# Altium schematic sheet CON_USER_BATTER.SchDoc
size 558 x 431 mm
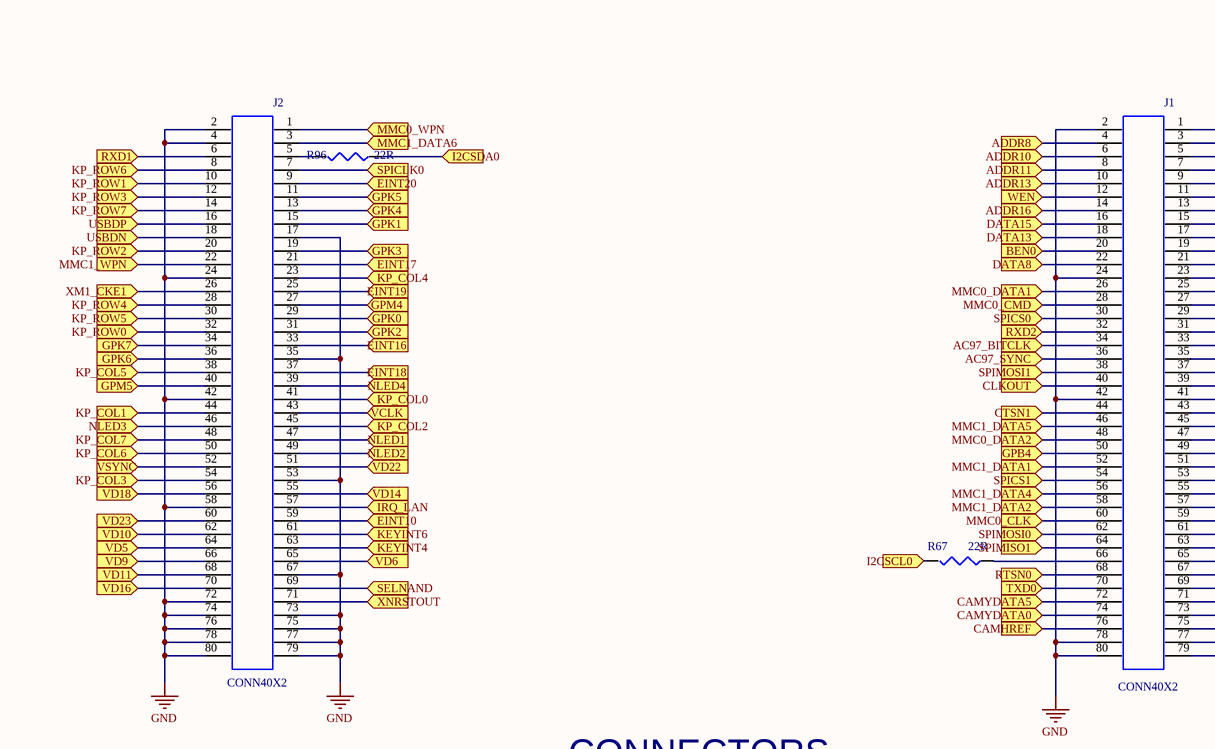
[diagram p0: CON_USER_BATTER.SchDoc, top left]
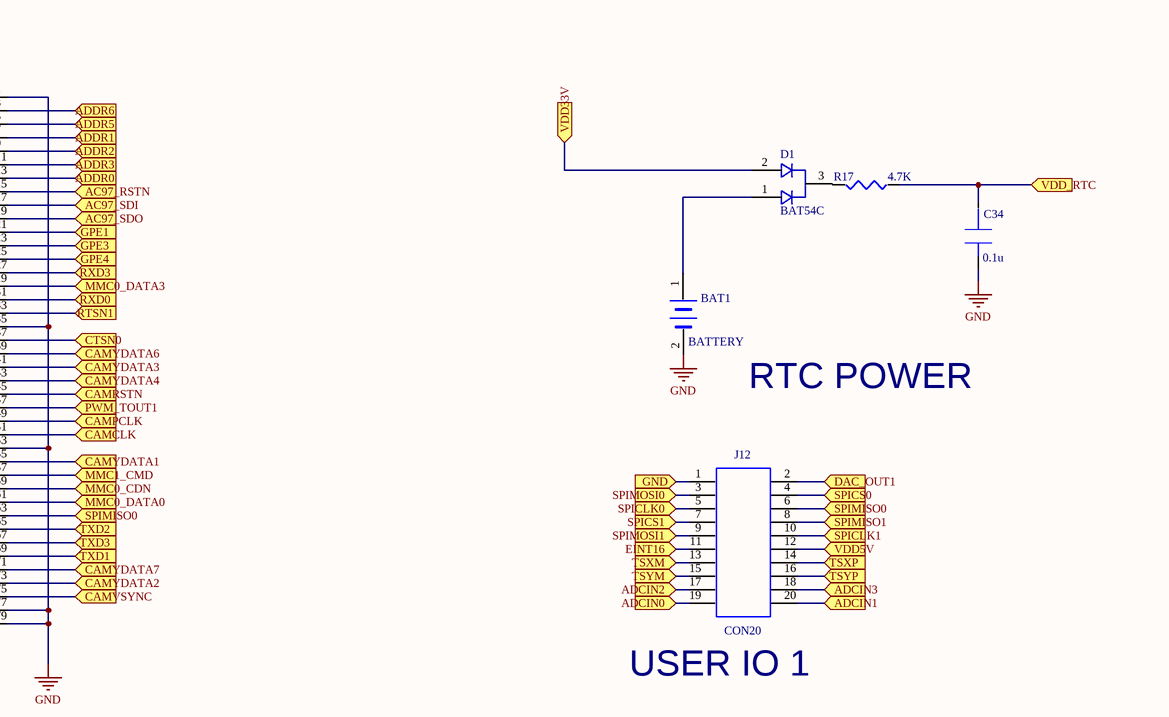
[diagram p1: CON_USER_BATTER.SchDoc, top right]
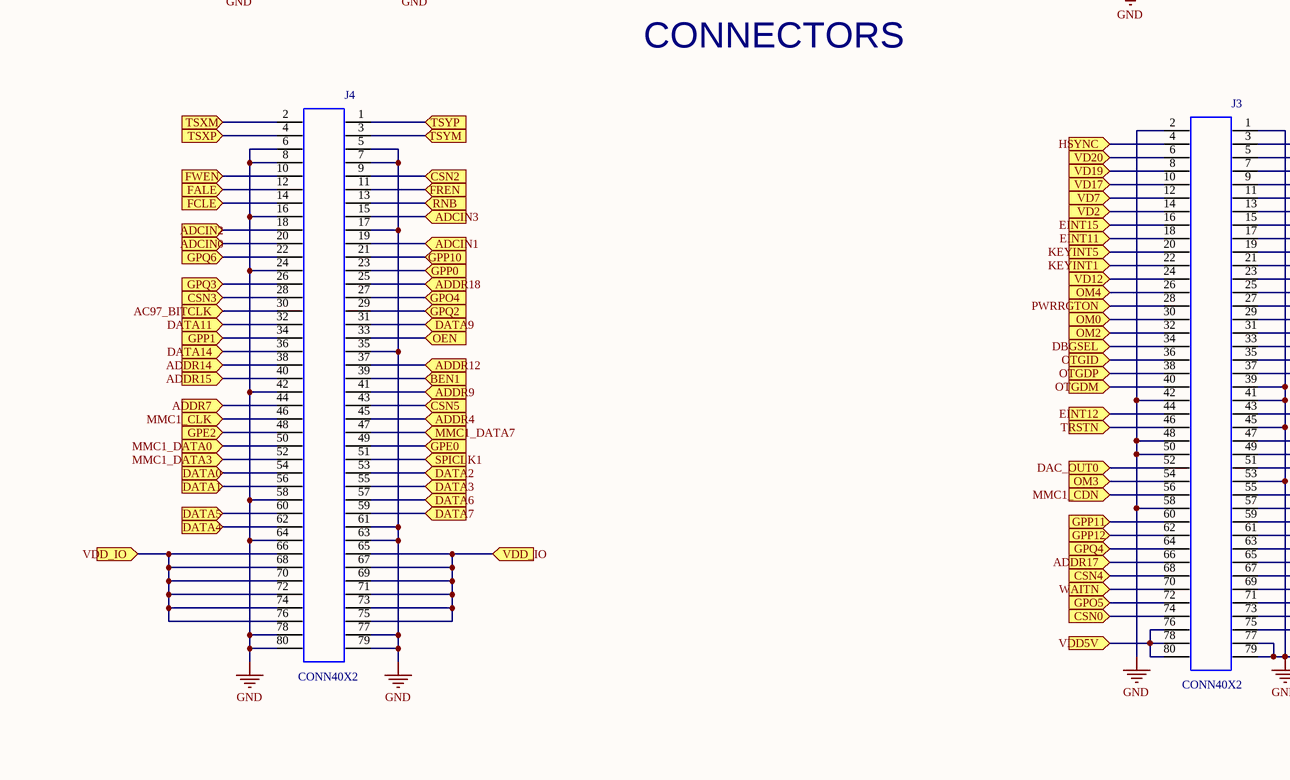
[diagram p2: CON_USER_BATTER.SchDoc, bottom left]
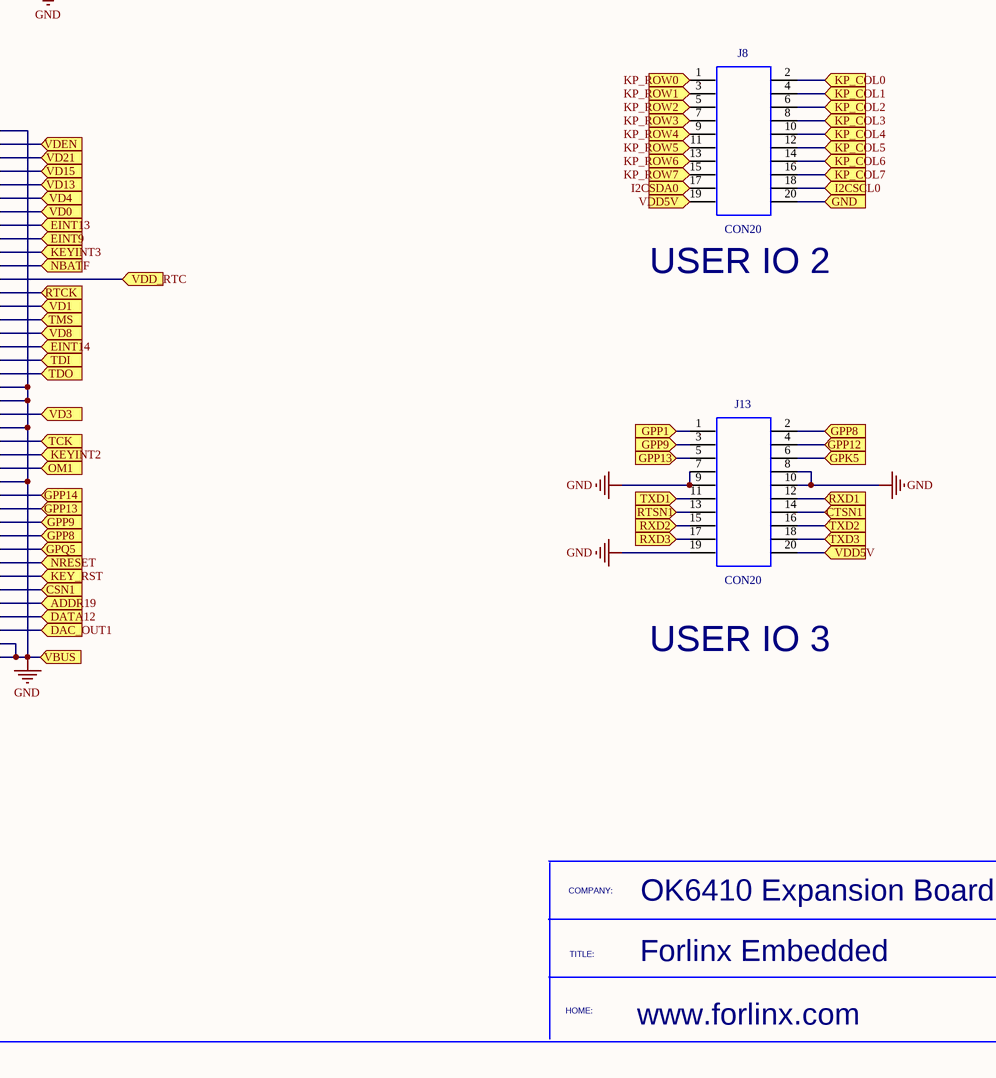
[diagram p3: CON_USER_BATTER.SchDoc, bottom right]

## Parts
BAT1  BATTERY
C34  value 0.1u  (hidden comment: CAP1206)
D1  BAT54C  [SOT23]
J1  CONN40X2
J2  CONN40X2
J3  CONN40X2
J4  CONN40X2
J8  CON20
J12  CON20
J13  CON20
R17  value 4.7K  (hidden comment: RESISTOR_2)
R67  value 22R  (hidden comment: RESISTOR_2)
R96  value 22R  (hidden comment: RESISTOR_2)

## Ports
AC97_BITCLK, AC97_RSTN, AC97_SDI, AC97_SDO, AC97_SYNC, ADCIN0, ADCIN1, ADCIN2, ADCIN3, ADDR0, ADDR1, ADDR2, ADDR3, ADDR4, ADDR5, ADDR6, ADDR7, ADDR8, ADDR9, ADDR10, ADDR11, ADDR12, ADDR13, ADDR14, ADDR15, ADDR16, ADDR17, ADDR18, ADDR19, BEN0, BEN1, CAMCLK, CAMHREF, CAMPCLK, CAMRSTN, CAMVSYNC, CAMYDATA0, CAMYDATA1, CAMYDATA2, CAMYDATA3, CAMYDATA4, CAMYDATA5, CAMYDATA6, CAMYDATA7, CLKOUT, CSN0, CSN1, CSN2, CSN3, CSN4, CSN5, CTSN0, CTSN1, DAC_OUT0, DAC_OUT1, DATA0, DATA1, DATA2, DATA3, DATA4, DATA5, DATA6, DATA7, DATA8, DATA9, DATA11, DATA12, DATA13, DATA14, DATA15, DBGSEL, EINT9, EINT10, EINT11, EINT12, EINT13, EINT14, EINT15, EINT16, EINT17, EINT18, EINT19, EINT20, FALE, FCLE, FREN, FWEN, GND, GPB4, GPE0, GPE1, GPE2, GPE3, GPE4, GPK0, GPK1, GPK2, GPK3, GPK4, GPK5, GPK6, GPK7, GPM4, GPM5, GPO4, GPO5, GPP0, GPP1, GPP8, GPP9, GPP10, GPP11, GPP12, GPP13, GPP14, GPQ2, GPQ3, GPQ4, GPQ5, GPQ6, HSYNC, I2CSCL0, I2CSDA0, IRQ_LAN, KEY_RST, KEYINT1, KEYINT2, KEYINT3, KEYINT4, KEYINT5, KEYINT6, KP_COL0, KP_COL1, KP_COL2, KP_COL3, KP_COL4, KP_COL5, KP_COL6, KP_COL7, KP_ROW0, KP_ROW1, KP_ROW2, KP_ROW3, KP_ROW4, KP_ROW5, KP_ROW6, KP_ROW7, MMC0_CDN, MMC0_CLK, MMC0_CMD, MMC0_DATA0, MMC0_DATA1, MMC0_DATA2, MMC0_DATA3, MMC0_WPN, MMC1_CDN, MMC1_CLK, MMC1_CMD, MMC1_DATA0, MMC1_DATA1, MMC1_DATA2, MMC1_DATA3, MMC1_DATA4, MMC1_DATA5, MMC1_DATA6, MMC1_DATA7, MMC1_WPN, NBATF, NLED1, NLED2, NLED3, NLED4, NRESET, OEN, OM0, OM1, OM2, OM3, OM4, OTGDM, OTGDP, OTGID, PWM_TOUT1, PWRRGTON, RNB, RTCK, RTSN0, RTSN1, RXD0, RXD1, RXD2, RXD3, SELNAND, SPICLK0, SPICLK1, SPICS0, SPICS1, SPIMISO0, SPIMISO1, SPIMOSI0, SPIMOSI1, TCK, TDI, TDO, TMS, TRSTN, TSXM, TSXP, TSYM, TSYP, TXD0, TXD1, TXD2, TXD3, USBDN, USBDP, VBUS, VCLK, VD0, VD1, VD2, VD3, VD4, VD5, VD6, VD7, VD8, VD9, VD10, VD11, VD12, VD13, VD14, VD15, VD16, VD17, VD18, VD19, VD20, VD21, VD22, VD23, VDD5V, VDD33V, VDD_IO, VDD_RTC, VDEN, VSYNC, WAITN, WEN, XM1_CKE1, XNRSTOUT

## Nets
GND: BAT1.2 C34.2 J1.1 J1.2 J1.24 J1.35 J1.42 J1.53 J1.77 J1.78 J1.79 J1.80 J2.2 J2.4 J2.17 J2.24 J2.35 J2.42 J2.53 J2.58 J2.67 J2.72 J2.73 J2.74 J2.75 J2.76 J2.77 J2.78 J2.79 J2.80 J3.1 J3.2 J3.39 J3.41 J3.42 J3.45 J3.48 J3.50 J3.53 J3.58 J3.77 J3.79 J4.5 J4.6 J4.7 J4.8 J4.16 J4.17 J4.24 J4.35 J4.42 J4.58 J4.61 J4.63 J4.64 J4.77 J4.78 J4.79 J4.80 J13.7 J13.8 J13.9 J13.10 J13.19 ; port VBUS
AC97_BITCLK: J1.34 J4.30 ; port AC97_BITCLK
AC97_RSTN: J1.15 ; port AC97_RSTN
AC97_SDI: J1.17 ; port AC97_SDI
AC97_SDO: J1.19 ; port AC97_SDO
AC97_SYNC: J1.36 ; port AC97_SYNC
ADCIN0: J4.20 J12.19 ; port ADCIN0
ADCIN1: J4.19 J12.20 ; port ADCIN1
ADCIN2: J4.18 J12.17 ; port ADCIN2
ADCIN3: J4.15 J12.18 ; port ADCIN3
ADDR0: J1.13 ; port ADDR0
ADDR1: J1.7 ; port ADDR1
ADDR2: J1.9 ; port ADDR2
ADDR3: J1.11 ; port ADDR3
ADDR4: J4.45 ; port ADDR4
ADDR5: J1.5 ; port ADDR5
ADDR6: J1.3 ; port ADDR6
ADDR7: J4.44 ; port ADDR7
ADDR8: J1.4 ; port ADDR8
ADDR9: J4.41 ; port ADDR9
ADDR10: J1.6 ; port ADDR10
ADDR11: J1.8 ; port ADDR11
ADDR12: J4.37 ; port ADDR12
ADDR13: J1.10 ; port ADDR13
ADDR14: J4.38 ; port ADDR14
ADDR15: J4.40 ; port ADDR15
ADDR16: J1.14 ; port ADDR16
ADDR17: J3.66 ; port ADDR17
ADDR18: J4.25 ; port ADDR18
ADDR19: J3.71 ; port ADDR19
BEN0: J1.20 ; port BEN0
BEN1: J4.39 ; port BEN1
CAMCLK: J1.51 ; port CAMCLK
CAMHREF: J1.76 ; port CAMHREF
CAMPCLK: J1.49 ; port CAMPCLK
CAMRSTN: J1.45 ; port CAMRSTN
CAMVSYNC: J1.75 ; port CAMVSYNC
CAMYDATA0: J1.74 ; port CAMYDATA0
CAMYDATA1: J1.55 ; port CAMYDATA1
CAMYDATA2: J1.73 ; port CAMYDATA2
CAMYDATA3: J1.41 ; port CAMYDATA3
CAMYDATA4: J1.43 ; port CAMYDATA4
CAMYDATA5: J1.72 ; port CAMYDATA5
CAMYDATA6: J1.39 ; port CAMYDATA6
CAMYDATA7: J1.71 ; port CAMYDATA7
CLKOUT: J1.40 ; port CLKOUT
CSN0: J3.74 ; port CSN0
CSN1: J3.69 ; port CSN1
CSN2: J4.9 ; port CSN2
CSN3: J4.28 ; port CSN3
CSN4: J3.68 ; port CSN4
CSN5: J4.43 ; port CSN5
CTSN0: J1.37 ; port CTSN0
CTSN1: J1.44 J13.14 ; port CTSN1
DAC_OUT0: J3.52 ; port DAC_OUT0
DAC_OUT1: J3.75 J12.2 ; port DAC_OUT1
DATA0: J4.54 ; port DATA0
DATA1: J4.56 ; port DATA1
DATA2: J4.53 ; port DATA2
DATA3: J4.55 ; port DATA3
DATA4: J4.62 ; port DATA4
DATA5: J4.60 ; port DATA5
DATA6: J4.57 ; port DATA6
DATA7: J4.59 ; port DATA7
DATA8: J1.22 ; port DATA8
DATA9: J4.31 ; port DATA9
DATA11: J4.32 ; port DATA11
DATA12: J3.73 ; port DATA12
DATA13: J1.18 ; port DATA13
DATA14: J4.36 ; port DATA14
DATA15: J1.16 ; port DATA15
DBGSEL: J3.34 ; port DBGSEL
EINT9: J3.17 ; port EINT9
EINT10: J2.59 ; port EINT10
EINT11: J3.18 ; port EINT11
EINT12: J3.44 ; port EINT12
EINT13: J3.15 ; port EINT13
EINT14: J3.33 ; port EINT14
EINT15: J3.16 ; port EINT15
EINT16: J2.33 J12.11 ; port EINT16
EINT17: J2.21 ; port EINT17
EINT18: J2.37 ; port EINT18
EINT19: J2.25 ; port EINT19
EINT20: J2.9 ; port EINT20
FALE: J4.12 ; port FALE
FCLE: J4.14 ; port FCLE
FREN: J4.11 ; port FREN
FWEN: J4.10 ; port FWEN
GND: J8.20 J12.1 ; port GND  [a separate net that carries the same name]
GPB4: J1.50 ; port GPB4
GPE0: J4.49 ; port GPE0
GPE1: J1.21 ; port GPE1
GPE2: J4.48 ; port GPE2
GPE3: J1.23 ; port GPE3
GPE4: J1.25 ; port GPE4
GPK0: J2.29 ; port GPK0
GPK1: J2.15 ; port GPK1
GPK2: J2.31 ; port GPK2
GPK3: J2.19 ; port GPK3
GPK4: J2.13 ; port GPK4
GPK5: J2.11 J13.6 ; port GPK5
GPK6: J2.36 ; port GPK6
GPK7: J2.34 ; port GPK7
GPM4: J2.27 ; port GPM4
GPM5: J2.40 ; port GPM5
GPO4: J4.27 ; port GPO4
GPO5: J3.72 ; port GPO5
GPP0: J4.23 ; port GPP0
GPP1: J4.34 J13.1 ; port GPP1
GPP8: J3.61 J13.2 ; port GPP8
GPP9: J3.59 J13.3 ; port GPP9
GPP10: J4.21 ; port GPP10
GPP11: J3.60 ; port GPP11
GPP12: J3.62 J13.4 ; port GPP12
GPP13: J3.57 J13.5 ; port GPP13
GPP14: J3.55 ; port GPP14
GPQ2: J4.29 ; port GPQ2
GPQ3: J4.26 ; port GPQ3
GPQ4: J3.64 ; port GPQ4
GPQ5: J3.63 ; port GPQ5
GPQ6: J4.22 ; port GPQ6
HSYNC: J3.4 ; port HSYNC
I2CSCL0: J8.18 R67.2 ; port I2CSCL0
I2CSDA0: J8.17 R96.1 ; port I2CSDA0
IRQ_LAN: J2.57 ; port IRQ_LAN
KEY_RST: J3.67 ; port KEY_RST
KEYINT1: J3.22 ; port KEYINT1
KEYINT2: J3.49 ; port KEYINT2
KEYINT3: J3.19 ; port KEYINT3
KEYINT4: J2.63 ; port KEYINT4
KEYINT5: J3.20 ; port KEYINT5
KEYINT6: J2.61 ; port KEYINT6
KP_COL0: J2.41 J8.2 ; port KP_COL0
KP_COL1: J2.44 J8.4 ; port KP_COL1
KP_COL2: J2.45 J8.6 ; port KP_COL2
KP_COL3: J2.54 J8.8 ; port KP_COL3
KP_COL4: J2.23 J8.10 ; port KP_COL4
KP_COL5: J2.38 J8.12 ; port KP_COL5
KP_COL6: J2.50 J8.14 ; port KP_COL6
KP_COL7: J2.48 J8.16 ; port KP_COL7
KP_ROW0: J2.32 J8.1 ; port KP_ROW0
KP_ROW1: J2.10 J8.3 ; port KP_ROW1
KP_ROW2: J2.20 J8.5 ; port KP_ROW2
KP_ROW3: J2.12 J8.7 ; port KP_ROW3
KP_ROW4: J2.28 J8.9 ; port KP_ROW4
KP_ROW5: J2.30 J8.11 ; port KP_ROW5
KP_ROW6: J2.8 J8.13 ; port KP_ROW6
KP_ROW7: J2.14 J8.15 ; port KP_ROW7
MMC0_CDN: J1.59 ; port MMC0_CDN
MMC0_CLK: J1.60 ; port MMC0_CLK
MMC0_CMD: J1.28 ; port MMC0_CMD
MMC0_DATA0: J1.61 ; port MMC0_DATA0
MMC0_DATA1: J1.26 ; port MMC0_DATA1
MMC0_DATA2: J1.48 ; port MMC0_DATA2
MMC0_DATA3: J1.29 ; port MMC0_DATA3
MMC0_WPN: J2.1 ; port MMC0_WPN
MMC1_CDN: J3.56 ; port MMC1_CDN
MMC1_CLK: J4.46 ; port MMC1_CLK
MMC1_CMD: J1.57 ; port MMC1_CMD
MMC1_DATA0: J4.50 ; port MMC1_DATA0
MMC1_DATA1: J1.52 ; port MMC1_DATA1
MMC1_DATA2: J1.58 ; port MMC1_DATA2
MMC1_DATA3: J4.52 ; port MMC1_DATA3
MMC1_DATA4: J1.56 ; port MMC1_DATA4
MMC1_DATA5: J1.46 ; port MMC1_DATA5
MMC1_DATA6: J2.3 ; port MMC1_DATA6
MMC1_DATA7: J4.47 ; port MMC1_DATA7
MMC1_WPN: J2.22 ; port MMC1_WPN
NBATF: J3.21 ; port NBATF
NLED1: J2.47 ; port NLED1
NLED2: J2.49 ; port NLED2
NLED3: J2.46 ; port NLED3
NLED4: J2.39 ; port NLED4
NRESET: J3.65 ; port NRESET
OEN: J4.33 ; port OEN
OM0: J3.30 ; port OM0
OM1: J3.51 ; port OM1
OM2: J3.32 ; port OM2
OM3: J3.54 ; port OM3
OM4: J3.26 ; port OM4
OTGDM: J3.40 ; port OTGDM
OTGDP: J3.38 ; port OTGDP
OTGID: J3.36 ; port OTGID
PWM_TOUT1: J1.47 ; port PWM_TOUT1
PWRRGTON: J3.28 ; port PWRRGTON
RNB: J4.13 ; port RNB
RTCK: J3.25 ; port RTCK
RTSN0: J1.68 ; port RTSN0
RTSN1: J1.33 J13.13 ; port RTSN1
RXD0: J1.31 ; port RXD0
RXD1: J2.6 J13.12 ; port RXD1
RXD2: J1.32 J13.15 ; port RXD2
RXD3: J1.27 J13.17 ; port RXD3
SELNAND: J2.69 ; port SELNAND
SPICLK0: J2.7 J12.5 ; port SPICLK0
SPICLK1: J4.51 J12.10 ; port SPICLK1
SPICS0: J1.30 J12.4 ; port SPICS0
SPICS1: J1.54 J12.7 ; port SPICS1
SPIMISO0: J1.63 J12.6 ; port SPIMISO0
SPIMISO1: J1.64 J12.8 ; port SPIMISO1
SPIMOSI0: J1.62 J12.3 ; port SPIMOSI0
SPIMOSI1: J1.38 J12.9 ; port SPIMOSI1
TCK: J3.47 ; port TCK
TDI: J3.35 ; port TDI
TDO: J3.37 ; port TDO
TMS: J3.29 ; port TMS
TRSTN: J3.46 ; port TRSTN
TSXM: J4.2 J12.13 ; port TSXM
TSXP: J4.4 J12.14 ; port TSXP
TSYM: J4.3 J12.15 ; port TSYM
TSYP: J4.1 J12.16 ; port TSYP
TXD0: J1.70 ; port TXD0
TXD1: J1.69 J13.11 ; port TXD1
TXD2: J1.65 J13.16 ; port TXD2
TXD3: J1.67 J13.18 ; port TXD3
USBDN: J2.18 ; port USBDN
USBDP: J2.16 ; port USBDP
VCLK: J2.43 ; port VCLK
VD0: J3.13 ; port VD0
VD1: J3.27 ; port VD1
VD2: J3.14 ; port VD2
VD3: J3.43 ; port VD3
VD4: J3.11 ; port VD4
VD5: J2.64 ; port VD5
VD6: J2.65 ; port VD6
VD7: J3.12 ; port VD7
VD8: J3.31 ; port VD8
VD9: J2.66 ; port VD9
VD10: J2.62 ; port VD10
VD11: J2.68 ; port VD11
VD12: J3.24 ; port VD12
VD13: J3.9 ; port VD13
VD14: J2.55 ; port VD14
VD15: J3.7 ; port VD15
VD16: J2.70 ; port VD16
VD17: J3.10 ; port VD17
VD18: J2.56 ; port VD18
VD19: J3.8 ; port VD19
VD20: J3.6 ; port VD20
VD21: J3.5 ; port VD21
VD22: J2.51 ; port VD22
VD23: J2.60 ; port VD23
VDD5V: J3.76 J3.78 J3.80 J8.19 J12.12 J13.20 ; port VDD5V
VDD33V: D1.2 ; port VDD33V
VDD_IO: J4.65 J4.66 J4.67 J4.68 J4.69 J4.70 J4.71 J4.72 J4.73 J4.74 J4.75 J4.76 ; port VDD_IO
VDD_RTC: C34.1 J3.23 R17.1 ; port VDD_RTC
VDEN: J3.3 ; port VDEN
VSYNC: J2.52 ; port VSYNC
WAITN: J3.70 ; port WAITN
WEN: J1.12 ; port WEN
XM1_CKE1: J2.26 ; port XM1_CKE1
XNRSTOUT: J2.71 ; port XNRSTOUT
NetBAT1_1: BAT1.1 D1.1
NetJ1_66: J1.66 R67.1
NetJ2_5: J2.5 R96.2

Not connected (* = marked no-connect by the designer): D1 3; R17 2

## Notes on the sheet
- RTC POWER
- (near J12) USER IO 1
- CONNECTORS
- (near J8) USER IO 2
- USER IO 3
- COMPANY:
- OK6410 Expansion Board
- TITLE:
- Forlinx Embedded
- HOME:
- www.forlinx.com

## Library data of the parts
BAT1 = BATTERY: PCB DECAL: BATTERY2
C34 = CAP1206: SURFACE MOUNT CAPACITOR 0.062 X 0.126 INCHES; Manufacturer #1: IPC SM-782 STD.; PCB DECAL: 0603A
J1-J4 = CONN40X2: PCB DECAL: CON80A_08_D
J8 J12 J13 = CON20: PCB DECAL: IDC20S
R17 R67 R96 = RESISTOR_2: PCB Footprint: C2012; PCB DECAL: 0603A
D1 = BAT54C: Value: BAT54C